# Altium schematic sheet WL-CONNECTIONS.SchDoc
size 420 x 297 mm; CompanyName: 9; DocumentNumber: ТРАНСИВЕР «ВОЛК»; SheetNumber: 9
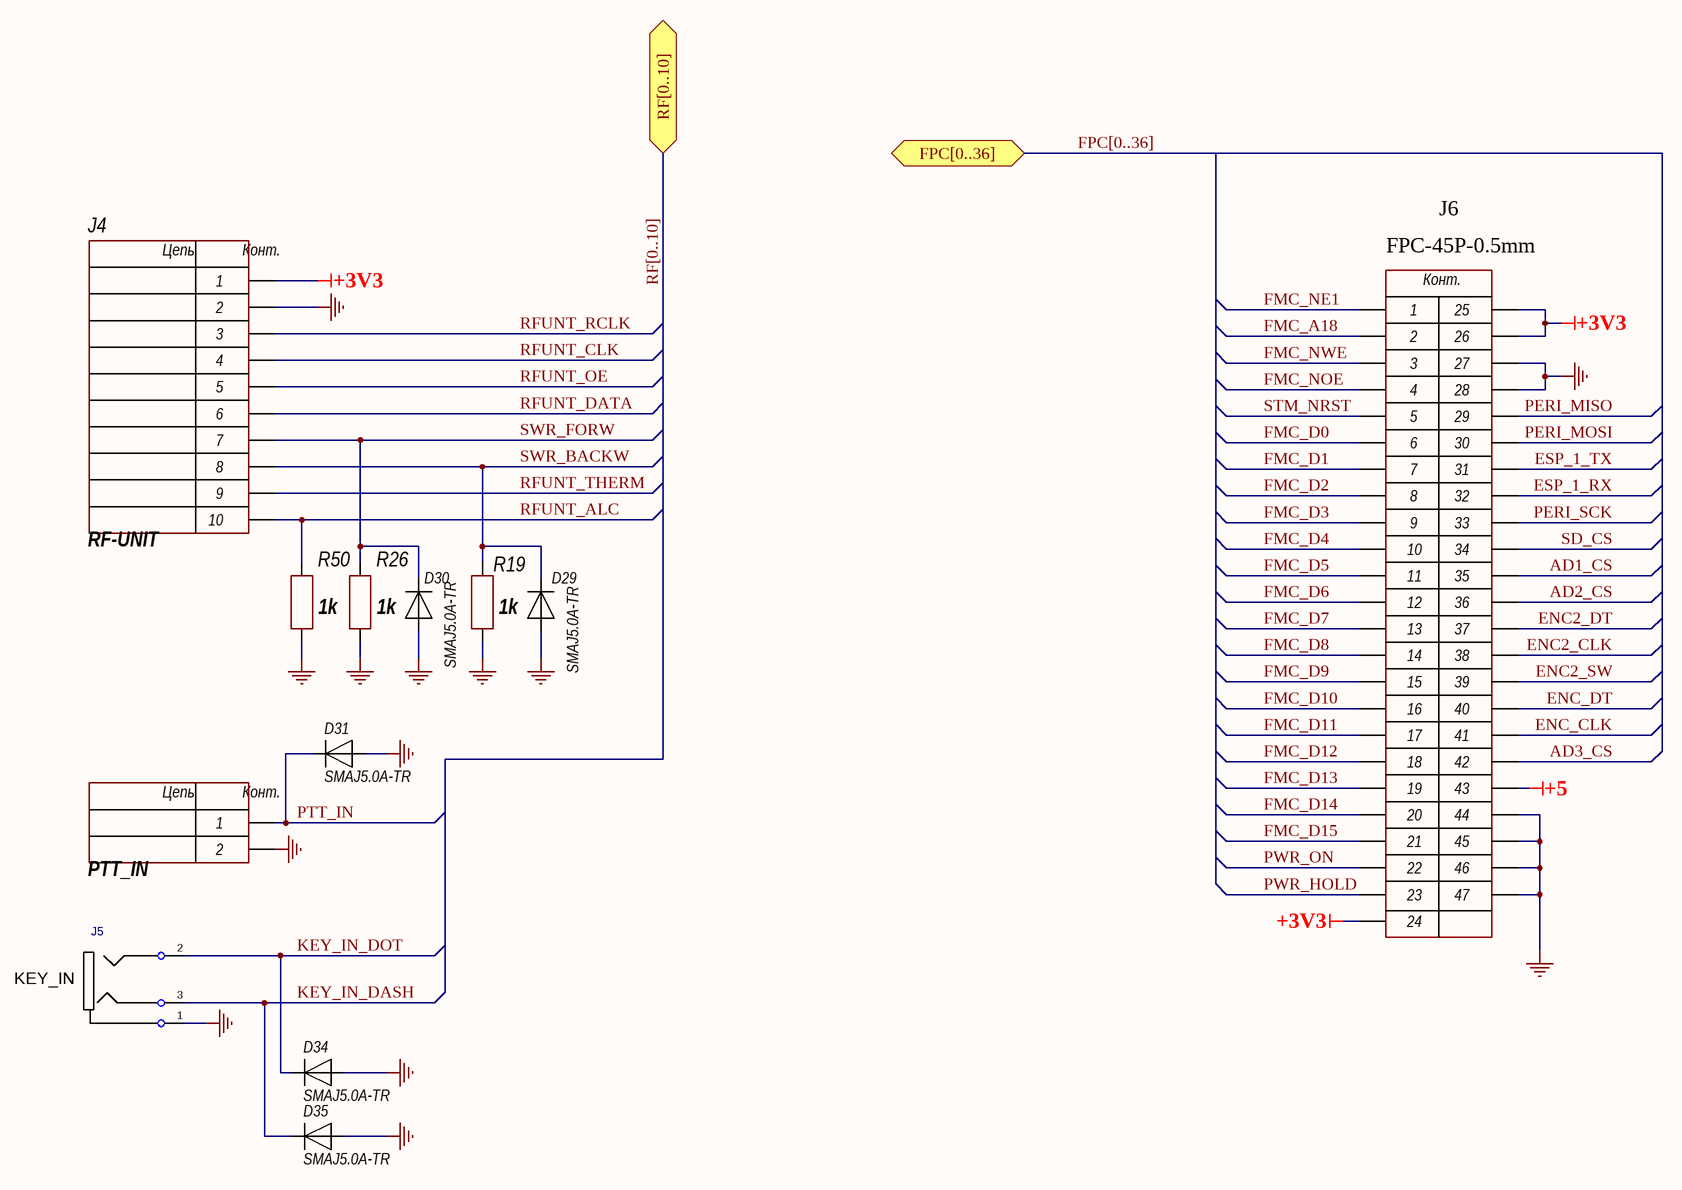
[diagram p0: WL-CONNECTIONS.SchDoc]

## Parts
D29  SMAJ5.0A-TR  [SOD123]
D30  SMAJ5.0A-TR  [SOD123]
D31  SMAJ5.0A-TR  [SOD123]
D34  SMAJ5.0A-TR  [SOD123]
D35  SMAJ5.0A-TR  [SOD123]
J4  RF-UNIT  [CON: 0533751010]
J5  value KEY_IN  [SJ1-3525NG]  (hidden comment: SJ1-3525NG)
J6  FPC-45P-0.5mm  [FPC-45-0.5]
R19  1k  [CH0805R]
R26  1k  [CH0805R]
R50  1k  [CH0805R]
X?  PTT_IN  [CON: 300-02P-5.0]

## Ports
FPC[0..36] (bidir), RF[0..10] (bidir)

## Nets
+3V3: J4.1 J6.24 J6.25 J6.26
+5: J6.43
GND: D29.1 D30.1 D31.1 D34.1 D35.1 J4.2 J5.1(sleeve) J6.27 J6.28 J6.44 J6.45 J6.46 J6.47 R19.2 R26.2 R50.2 X?.2
AD1_CS: J6.35
AD2_CS: J6.36
AD3_CS: J6.42
ENC2_CLK: J6.38
ENC2_DT: J6.37
ENC2_SW: J6.39
ENC_CLK: J6.41
ENC_DT: J6.40
ESP_1_RX: J6.32
ESP_1_TX: J6.31
FMC_A18: J6.2
FMC_D0: J6.6
FMC_D1: J6.7
FMC_D2: J6.8
FMC_D3: J6.9
FMC_D4: J6.10
FMC_D5: J6.11
FMC_D6: J6.12
FMC_D7: J6.13
FMC_D8: J6.14
FMC_D9: J6.15
FMC_D10: J6.16
FMC_D11: J6.17
FMC_D12: J6.18
FMC_D13: J6.19
FMC_D14: J6.20
FMC_D15: J6.21
FMC_NE1: J6.1
FMC_NOE: J6.4
FMC_NWE: J6.3
KEY_IN_DASH: D35.2 J5.3(ring)
KEY_IN_DOT: D34.2 J5.2(tip)
PERI_MISO: J6.29
PERI_MOSI: J6.30
PERI_SCK: J6.33
PTT_IN: D31.2 X?.1
PWR_HOLD: J6.23
PWR_ON: J6.22
RFUNT_ALC: J4.10 R50.1
RFUNT_CLK: J4.4
RFUNT_DATA: J4.6
RFUNT_OE: J4.5
RFUNT_RCLK: J4.3
RFUNT_THERM: J4.9
SD_CS: J6.34
STM_NRST: J6.5
SWR_BACKW: D29.2 J4.8 R19.1
SWR_FORW: D30.2 J4.7 R26.1

## Buses and harness runs
bus FPC[0..36] = port FPC[0..36]
bus RF[0..10] = port RF[0..10]

## Notes on the sheet
- Подп. и дата
- Инв. № дубл.
- Взам. инв. №
- Инв. № подл.
- Изм.
- Лист
- № докум.
- Подп.
- Дата
- 2.106-A3
- Копировал
- Формат А3
- (in symbol 2-Connector) Цепь; Конт.
- (in symbol 10-Connector) Цепь; Конт.
- (in symbol 47-PIN) Конт.

## Library data of the parts
D29-D31 D34 D35 = Diod: ComponentKind: *; Manufacturer: *; Model: *; HelpURL: *
J4 = 10-Connector: Model: *; Manufacturer: *; HelpURL: *; ComponentKind: *
J5 = SJ1-3523N
J6 = 47-PIN
R19 R26 R50 = Resistor: Manufacturer: *; Model: *; HelpURL: *; ComponentKind: *; Value: *
X? = 2-Connector: Model: *; Manufacturer: *; HelpURL: *; ComponentKind: *